# Altium schematic sheet SOM_IO2.SchDoc
size A4
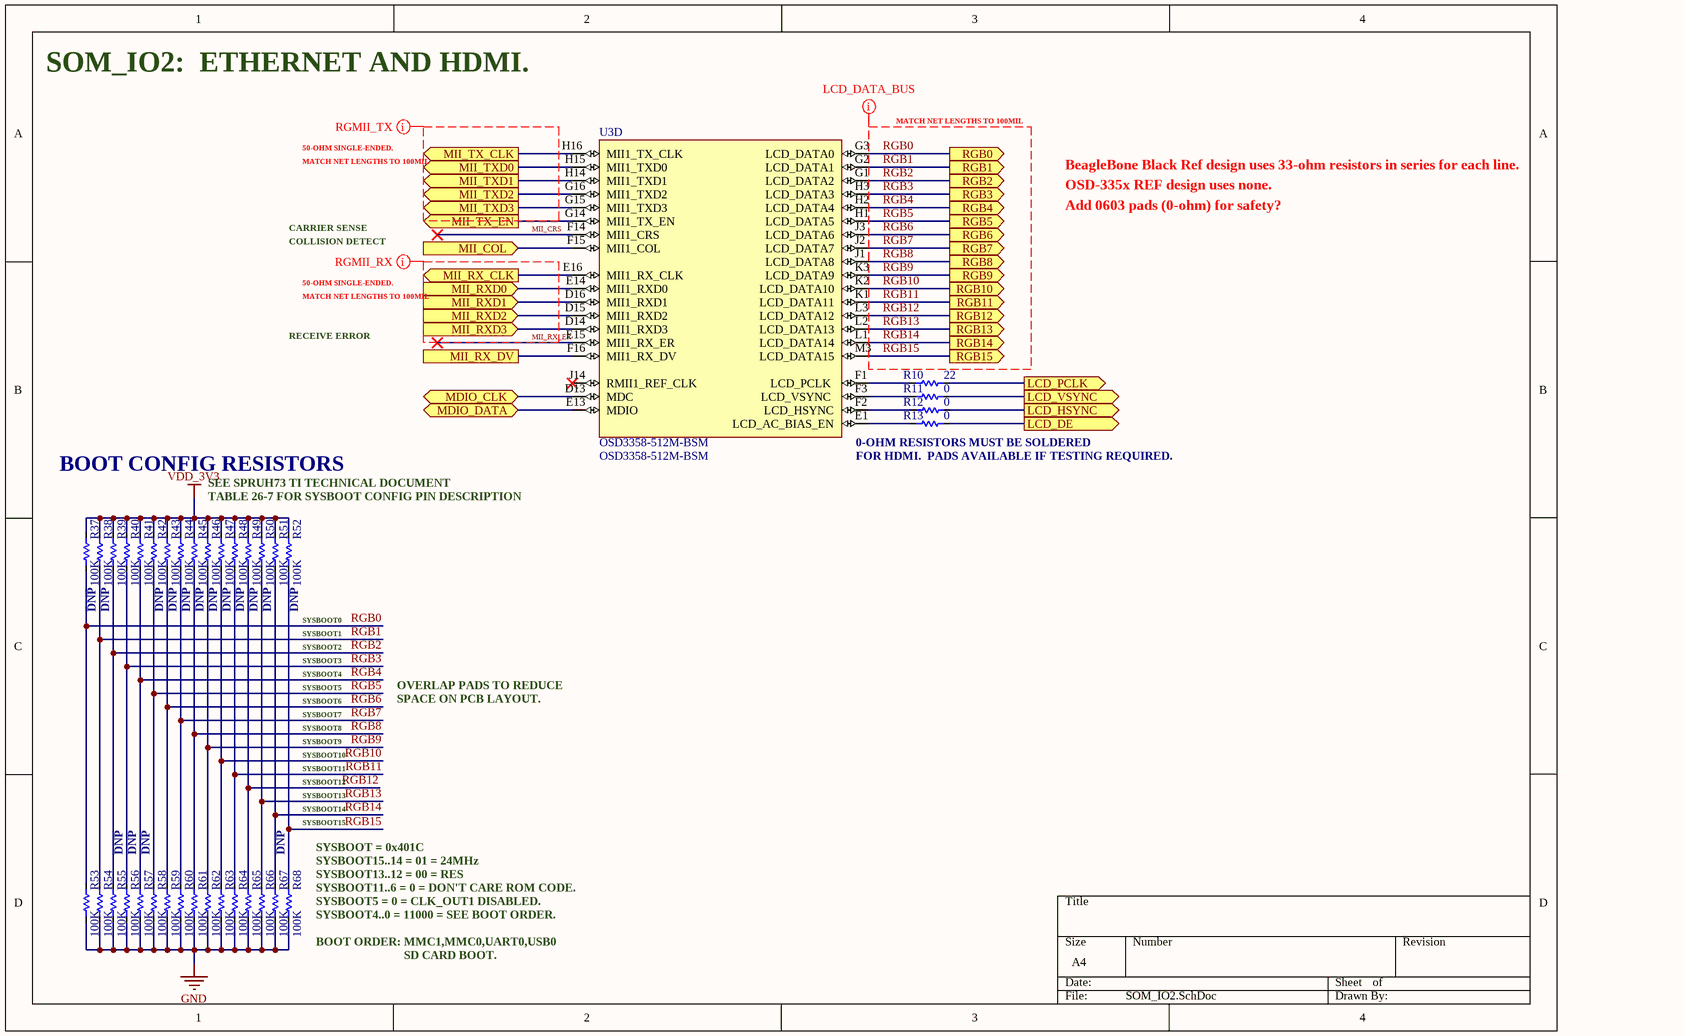
[diagram p0: SOM_IO2.SchDoc]

## Parts
R10  22  [RES_0603]
R11  0  [RES_0603]
R12  0  [RES_0603]
R13  0  [RES_0603]
R37  100K  [RES_0402]
R38  100K  [RES_0402]
R39  100K  [RES_0402]
R40  100K  [RES_0402]
R41  100K  [RES_0402]
R42  100K  [RES_0402]
R43  100K  [RES_0402]
R44  100K  [RES_0402]
R45  100K  [RES_0402]
R46  100K  [RES_0402]
R47  100K  [RES_0402]
R48  100K  [RES_0402]
R49  100K  [RES_0402]
R50  100K  [RES_0402]
R51  100K  [RES_0402]
R52  100K  [RES_0402]
R53  100K  [RES_0402]
R54  100K  [RES_0402]
R55  100K  [RES_0402]
R56  100K  [RES_0402]
R57  100K  [RES_0402]
R58  100K  [RES_0402]
R59  100K  [RES_0402]
R60  100K  [RES_0402]
R61  100K  [RES_0402]
R62  100K  [RES_0402]
R63  100K  [RES_0402]
R64  100K  [RES_0402]
R65  100K  [RES_0402]
R66  100K  [RES_0402]
R67  100K  [RES_0402]
R68  100K  [RES_0402]
U3  OSD3358-512M-BSM  [BGA256C127P16X16_2100X2100X308]  (part D of 6)

## Ports
LCD_DE (out), LCD_HSYNC (out), LCD_PCLK (out), LCD_VSYNC (out), MDIO_CLK (bidir), MDIO_DATA (bidir), MII_COL (in), MII_RX_CLK (out), MII_RX_DV, MII_RXD0 (in), MII_RXD1 (in), MII_RXD2 (in), MII_RXD3 (in), MII_TX_CLK (out), MII_TX_EN (out), MII_TXD0 (out), MII_TXD1 (out), MII_TXD2 (out), MII_TXD3 (out), RGB0 (out), RGB1 (out), RGB2 (out), RGB3 (out), RGB4 (out), RGB5 (out), RGB6 (out), RGB7 (out), RGB8 (out), RGB9 (out), RGB10 (out), RGB11 (out), RGB12 (out), RGB13 (out), RGB14 (out), RGB15 (out)

## Nets
GND: R53.1 R54.1 R55.1 R56.1 R57.1 R58.1 R59.1 R60.1 R61.1 R62.1 R63.1 R64.1 R65.1 R66.1 R67.1 R68.1
VDD_3V3: R37.2 R38.2 R39.2 R40.2 R41.2 R42.2 R43.2 R44.2 R45.2 R46.2 R47.2 R48.2 R49.2 R50.2 R51.2 R52.2
LCD_DE: R13.2 ; port LCD_DE
LCD_HSYNC: R12.2 ; port LCD_HSYNC
LCD_PCLK: R10.2 ; port LCD_PCLK
LCD_VSYNC: R11.2 ; port LCD_VSYNC
MDIO_CLK: U3.D13(MDC) ; port MDIO_CLK
MDIO_DATA: U3.E13(MDIO) ; port MDIO_DATA
MII_COL: U3.F15(MII1_COL) ; port MII_COL
MII_CRS: U3.F14(MII1_CRS)
MII_RX_CLK: U3.E16(MII1_RX_CLK) ; port MII_RX_CLK
MII_RX_DV: U3.F16(MII1_RX_DV) ; port MII_RX_DV
MII_RX_ER: U3.E15(MII1_RX_ER)
MII_RXD0: U3.E14(MII1_RXD0) ; port MII_RXD0
MII_RXD1: U3.D16(MII1_RXD1) ; port MII_RXD1
MII_RXD2: U3.D15(MII1_RXD2) ; port MII_RXD2
MII_RXD3: U3.D14(MII1_RXD3) ; port MII_RXD3
MII_TX_CLK: U3.H16(MII1_TX_CLK) ; port MII_TX_CLK
MII_TX_EN: U3.G14(MII1_TX_EN) ; port MII_TX_EN
MII_TXD0: U3.H15(MII1_TXD0) ; port MII_TXD0
MII_TXD1: U3.H14(MII1_TXD1) ; port MII_TXD1
MII_TXD2: U3.G16(MII1_TXD2) ; port MII_TXD2
MII_TXD3: U3.G15(MII1_TXD3) ; port MII_TXD3
RGB0: R37.1 R53.2 U3.G3(LCD_DATA0) ; port RGB0
RGB1: R38.1 R54.2 U3.G2(LCD_DATA1) ; port RGB1
RGB2: R39.1 R55.2 U3.G1(LCD_DATA2) ; port RGB2
RGB3: R40.1 R56.2 U3.H3(LCD_DATA3) ; port RGB3
RGB4: R41.1 R57.2 U3.H2(LCD_DATA4) ; port RGB4
RGB5: R42.1 R58.2 U3.H1(LCD_DATA5) ; port RGB5
RGB6: R43.1 R59.2 U3.J3(LCD_DATA6) ; port RGB6
RGB7: R44.1 R60.2 U3.J2(LCD_DATA7) ; port RGB7
RGB8: R45.1 R61.2 U3.J1(LCD_DATA8) ; port RGB8
RGB9: R46.1 R62.2 U3.K3(LCD_DATA9) ; port RGB9
RGB10: R47.1 R63.2 U3.K2(LCD_DATA10) ; port RGB10
RGB11: R48.1 R64.2 U3.K1(LCD_DATA11) ; port RGB11
RGB12: R49.1 R65.2 U3.L3(LCD_DATA12) ; port RGB12
RGB13: R50.1 R66.2 U3.L2(LCD_DATA13) ; port RGB13
RGB14: R51.1 R67.2 U3.L1(LCD_DATA14) ; port RGB14
RGB15: R52.1 R68.2 U3.M3(LCD_DATA15) ; port RGB15
NetR10_1: R10.1 U3.F1(LCD_PCLK)
NetR11_1: R11.1 U3.F3(LCD_VSYNC)
NetR12_1: R12.1 U3.F2(LCD_HSYNC)
NetR13_1: R13.1 U3.E1(LCD_AC_BIAS_EN)

Not connected (* = marked no-connect by the designer): U3 J14(RMII1_REF_CLK)*

## Layout directives
net class RGMII_TX; net class Z50_SINGLE_RGMII; rule Matched Net Lengths [Tolerance = 100mil]: (no net found under the mark)
rule Matched Net Lengths [Tolerance = 100mil]; net class RGMII_RX; net class Z50_SINGLE_RGMII: MII_RX_ER
net class LCD_DATA_BUS; rule Matched Net Lengths [Tolerance = 100mil]: RGB0, RGB1, RGB2, RGB3, RGB4, RGB5, RGB6, RGB7, RGB8, RGB9, RGB10, RGB11, RGB12, RGB13, RGB14, RGB15

## Notes on the sheet
- SOM_IO2:  ETHERNET AND HDMI.
- MATCH NET LENGTHS TO 100MIL
- 50-OHM SINGLE-ENDED.
- BeagleBone Black Ref design uses 33-ohm resistors in series for each line.
- CARRIER SENSE
- COLLISION DETECT
- OSD-335x REF design uses none.
- Add 0603 pads (0-ohm) for safety?
- RECEIVE ERROR
- 0-OHM RESISTORS MUST BE SOLDERED
- BOOT CONFIG RESISTORS
- SEE SPRUH73 TI TECHNICAL DOCUMENT
- TABLE 26-7 FOR SYSBOOT CONFIG PIN DESCRIPTION
- FOR HDMI.  PADS AVAILABLE IF TESTING REQUIRED.
- DNP
- SYSBOOT0
- SYSBOOT1
- SYSBOOT2
- SYSBOOT3
- SYSBOOT4
- SYSBOOT5
- SYSBOOT6
- SYSBOOT7
- OVERLAP PADS TO REDUCE
- SPACE ON PCB LAYOUT.
- SYSBOOT8
- SYSBOOT9
- SYSBOOT10
- SYSBOOT11
- SYSBOOT12
- SYSBOOT13
- SYSBOOT14
- SYSBOOT15
- SYSBOOT = 0x401C
- SYSBOOT15..14 = 01 = 24MHz
- SYSBOOT13..12 = 00 = RES
- SYSBOOT11..6 = 0 = DON'T CARE ROM CODE.
- SYSBOOT5 = 0 = CLK_OUT1 DISABLED.
- SYSBOOT4..0 = 11000 = SEE BOOT ORDER.
- BOOT ORDER: MMC1,MMC0,UART0,USB0
- SD CARD BOOT.

## Library data of the parts
R10 = RC0603JR-0722RL: RES SMD 22 OHM 5% 1/10W 0603; Manufacturer: Yageo; Tolerance: 5%; Manufacturer Part No.: RC0603JR-0722RL; Date: 2020; ComponentLink1Description: Manufacturer Link; ComponentLink1URL: http://www.vishay.com/company/brands/dale/; ComponentLink2Description: Datasheet; ComponentLink2URL: http://www.vishay.com/docs/20035/dcrcwe3.pdf; Supplier: Digikey; Supplier Part No.: 311-22GRCT-ND; Datasheet: https://www.yageo.com/upload/media/product/productsearch/datasheet/rchip/PYu-RC_Group_51_RoHS_L_10.pdf; Package Reference: RES_0603; Package Description: 0603; Mounting Technology: SMD; Power Rating: 1/10W; Value: 22
R11-R13 = RC0603JR-070RL: RES SMD 0 OHM JUMPER 1/10W 0603; Manufacturer: Yageo; Manufacturer Part No.: RC0603JR-070RL; Date: 2020; ComponentLink1Description: Manufacturer Link; ComponentLink1URL: http://www.vishay.com/company/brands/dale/; ComponentLink2Description: Datasheet; ComponentLink2URL: http://www.vishay.com/docs/20035/dcrcwe3.pdf; Supplier: Digikey; Supplier Part No.: 311-0.0GRCT-ND; Datasheet: https://www.yageo.com/upload/media/product/productsearch/datasheet/rchip/PYu-RC_Group_51_RoHS_L_10.pdf; Package Reference: RES_0603; Package Description: 0603; Mounting Technology: SMD; Value: 0; Power Rating: 1/10W
R37-R68 = RC0402FR-07100KL: RES SMD 100K OHM 1% 1/16W 0402; Manufacturer: Yageo; Tolerance: 1%; Manufacturer Part No.: RC0402FR-07100KL; Date: 2020; ComponentLink1Description: Manufacturer Link; ComponentLink1URL: http://www.vishay.com/company/brands/dale/; ComponentLink2Description: Datasheet; ComponentLink2URL: http://www.vishay.com/docs/20035/dcrcwe3.pdf; Supplier: Digikey; Supplier Part No.: 311-100KLRCT-ND; Datasheet: https://www.yageo.com/upload/media/product/productsearch/datasheet/rchip/PYu-RC_Group_51_RoHS_L_10.pdf; Package Reference: RES_0402; Package Description: 0402; Mounting Technology: SMD; Value: 100K; Power Rating: 1/16W
U3 = SOM-OSD3358-512M-BSM: OSD3358-512M-BSM , 256-FBGA, 21mmx21mmx3mm; Manufacturer: Octavo Systems; Package: FBGA; Pin Count: 256-ball; Mounting Technology: SMD; ComponentLink1Description: Manufacturer URL; ComponentLink1URL: http://www.octavosystems.com/; PartNumber: OSD3358-512M-BSM; Package Description: 256-Ball Grid Array, 21x21x3 mm, Pitch 1.27 mm; Package Reference: FBGA-256; Supplier: Digi-Key; Supplier Part No.: 1676-1002-ND